# EAGLE schematic spi_example (EAGLE 7.2.0)
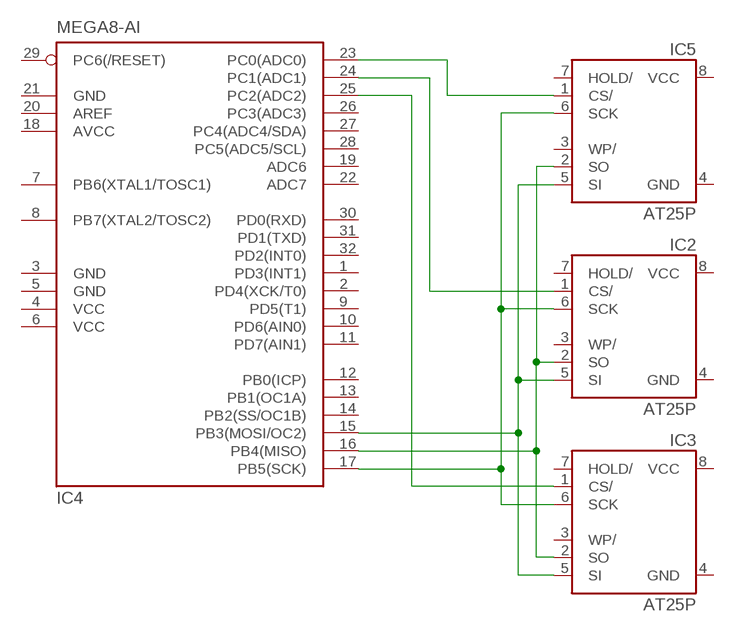
[diagram p0: schematic, sheet 1]

## Parts
IC2  AT25P  [DIL08]
IC3  AT25P  [DIL08]
IC4  MEGA8-AI  [TQFP32-08]
IC5  AT25P  [DIL08]

## Nets
N$1: IC2.2(SO) IC3.2(SO) IC4.16(PB4(MISO)) IC5.2(SO)
N$2: IC2.5(SI) IC3.5(SI) IC4.15(PB3(MOSI/OC2)) IC5.5(SI)
N$3: IC2.6(SCK) IC3.6(SCK) IC4.17(PB5(SCK)) IC5.6(SCK)
N$4: IC4.23(PC0(ADC0)) IC5.1(CS/)
N$5: IC2.1(CS/) IC4.24(PC1(ADC1))
N$6: IC3.1(CS/) IC4.25(PC2(ADC2))
Unconnected: IC2.3(WP/) IC2.7(HOLD/) IC3.3(WP/) IC3.7(HOLD/) IC4.1(PD3(INT1)) IC4.2(PD4(XCK/T0)) IC4.7(PB6(XTAL1/TOSC1)) IC4.8(PB7(XTAL2/TOSC2)) IC4.9(PD5(T1)) IC4.10(PD6(AIN0)) IC4.11(PD7(AIN1)) IC4.12(PB0(ICP)) IC4.13(PB1(OC1A)) IC4.14(PB2(SS/OC1B)) IC4.19(ADC6) IC4.20(AREF) IC4.22(ADC7) IC4.26(PC3(ADC3)) IC4.27(PC4(ADC4/SDA)) IC4.28(PC5(ADC5/SCL)) IC4.29(PC6(/RESET)) IC4.30(PD0(RXD)) IC4.31(PD1(TXD)) IC4.32(PD2(INT0)) IC5.3(WP/) IC5.7(HOLD/)

## Power pins joined to a net without a drawn wire
AVCC: IC4.18(AVCC)
GND: IC2.4(GND) IC3.4(GND) IC4.3(GND) IC4.5(GND) IC4.21(GND) IC5.4(GND)
VCC: IC2.8(VCC) IC3.8(VCC) IC4.4(VCC) IC4.6(VCC) IC5.8(VCC)

## Library data of the parts
IC2 IC3 IC5 = atmel:AT25*: SPI bus serial EEPROM; MPN: CAT25040LI-G; OC_FARNELL: 1718045; OC_NEWARK: 06R0588
IC4 = atmel:MEGA8: MICROCONTROLLER 8 Kbytes FLASH, 1 kbytes SRAM, 512 bytes EEPROM, USART, 6-channel 10 bit ADC, 2-channel 8 bit ADC Pin compatible with Atmega48, ATMega88, ATMega168 Source: avr.lbr; MPN: ATMEGA8-16AU; OC_FARNELL: 9171371; OC_NEWARK: 73M8863